# EAGLE design MIDI (EAGLE 6.5.0)
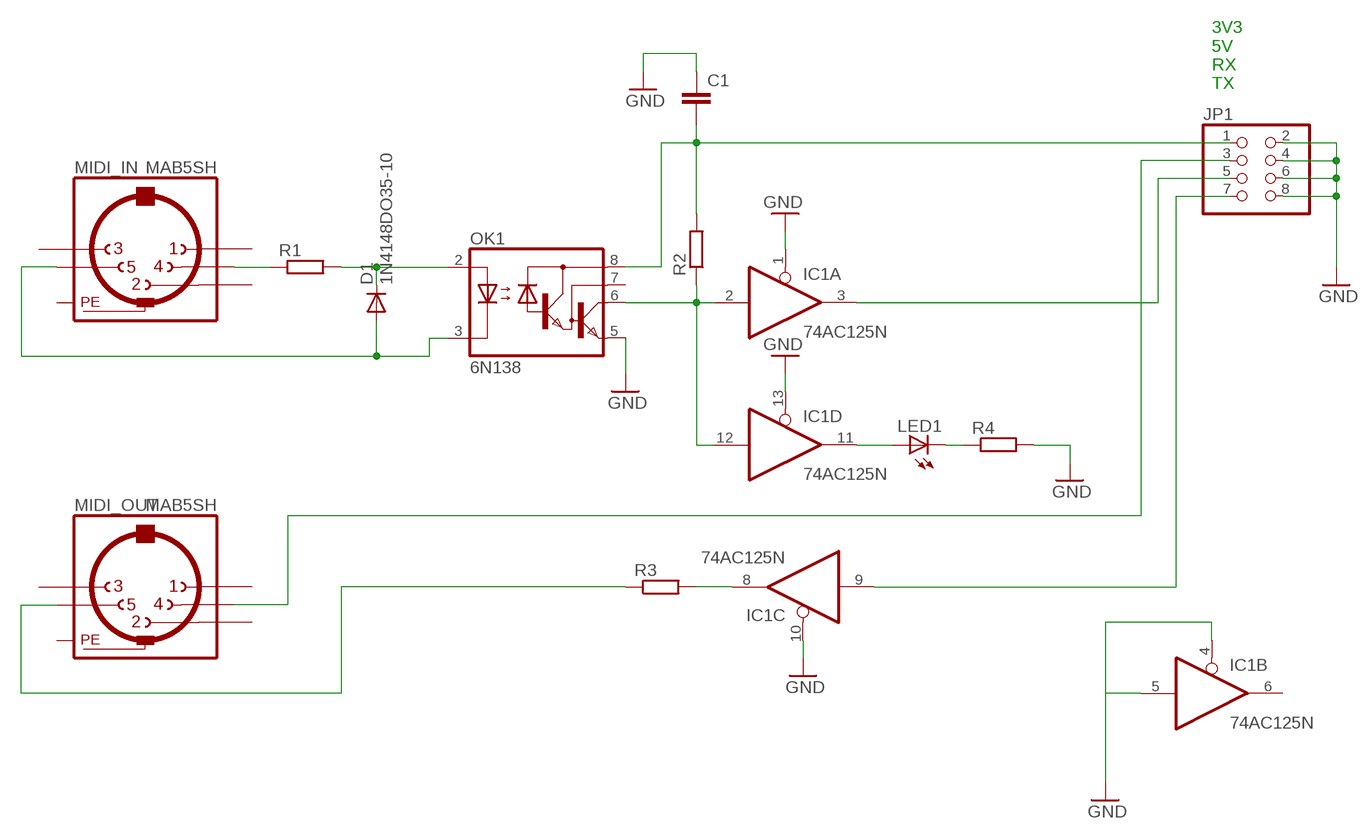
[diagram p0: schematic, sheet 1]

## Parts
C1  C-EU050-024X044  [C050-024X044]
D1  1N4148DO35-10  [DO35-10]
IC1  74AC125N  [DIL14]
JP1  PINHD-2X4  [2X04]
LED1  LED3MM  [LED3MM]
MIDI_IN  MAB5SH  [MAB5SH]
MIDI_OUT  MAB5SH  [MAB5SH]
OK1  6N138  [DIL08]
R1  R-EU_0207/5V  [0207/5V]
R2  R-EU_0207/5V  [0207/5V]
R3  R-EU_0207/5V  [0207/5V]
R4  R-EU_0207/5V  [0207/5V]

## Nets
GND: C1.1 IC1.1(A:OE) IC1.4(B:OE) IC1.5(B:I) IC1.10(C:OE) IC1.13(D:OE) JP1.2 JP1.4 JP1.6 JP1.8 OK1.5(GND) R4.2
N$1: MIDI_IN.4 R1.1
N$2: D1.C OK1.2(A) R1.2
N$3: D1.A MIDI_IN.5 OK1.3(C)
N$4: IC1.8(C:O) R3.2
N$5: IC1.2(A:I) IC1.12(D:I) OK1.6(VO) R2.1
N$6: IC1.3(A:O) JP1.5
N$7: MIDI_OUT.5 R3.1
N$8: JP1.3 MIDI_OUT.4
N$9: IC1.9(C:I) JP1.7
N$10: IC1.11(D:O) LED1.A
N$12: LED1.K(C) R4.1
VCC: C1.2 JP1.1 OK1.8(VCC) R2.2
Unconnected: IC1.6(B:O) MIDI_IN.1 MIDI_IN.2 MIDI_IN.3 MIDI_OUT.1 MIDI_OUT.2 MIDI_OUT.3 OK1.7(VB)

## Notes on the sheet
- 3V3
  5V
  RX
  TX

## Power pins joined to a net without a drawn wire
GND: IC1.7(P:GND) MIDI_IN.PE MIDI_IN.PE@(PE) MIDI_OUT.PE MIDI_OUT.PE@(PE)
VCC: IC1.14(P:VCC)

## Library data of the parts
C1 = resistor:C-EU: CAPACITOR, European symbol
D1 = diode:1N4148: DIODE high speed (Philips)
IC1 = 74xx-eu:74*125: Quad bus BUFFER, 3-state
JP1 = pinhead:PINHD-2X4: PIN HEADER
LED1 = led:LED: LED OSRAM: - CHIPLED LG R971, LG N971, LY N971, LG Q971, LY Q971, LO R971, LY R971 LH N974, LH R974 LS Q976, LO Q976, LY Q976 LO Q996 - Hyper CHIPLED LW Q18S LB Q993, LB Q99A, LB R99A - SideLED LS A670, LO A670, LY A670, LG A670, LP A670 LB A673, LV A673, LT A673, LW A673 LH A674 LY A675 LS A676, LA A676, LO A676, LY A676, LW A676 LS A679, LY A679, LG A679 - Hyper Micro SIDELED® LS Y876, LA Y876, LO Y876, LY Y876 LT Y87S - SmartLED LW L88C, LW L88S LB L89C, LB L89S, LG L890 LS L89K, LO L89K, LY L89K LS L896, LA L896, LO L896, LY L896 - TOPLED LS T670, LO T670, LY T670, LG T670, LP T670 LSG T670, LSP T670, LSY T670, LOP T670, LYG T670 LG T671, LOG T671, LSG T671 LB T673, LV T673, LT T673, LW T673 LH T674 LS T676, LA T676, LO T676, LY T676, LB T676, LH T676, LSB T676, LW T676 LB T67C, LV T67C, LT T67C, LS T67K, LO T67K, LY T67K, LW E67C LS E67B, LA E67B, LO E67B, LY E67B, LB E67C, LV E67C, LT E67C LW T67C LS T679, LY T679, LG T679 LS T770, LO T770, LY T770, LG T770, LP T770 LB T773, LV T773, LT T773, LW T773 LH T774 LS E675, LA E675, LY E675, LS T675 LS T776, LA T776, LO T776, LY T776, LB T776 LHGB T686 LT T68C, LB T68C - Hyper Mini TOPLED® LB M676 - Mini TOPLED Santana® LG M470 LS M47K, LO M47K, LY M47K Source: http://www.osram.convergy.de LUXEON: - LUMILED® LXK2-PW12-R00, LXK2-PW12-S00, LXK2-PW14-U00, LXK2-PW14-V00 LXK2-PM12-R00, LXK2-PM12-S00, LXK2-PM14-U00 LXK2-PE12-Q00, LXK2-PE12-R00, LXK2-PE12-S00, LXK2-PE14-T00, LXK2-PE14-U00 LXK2-PB12-K00, LXK2-PB12-L00, LXK2-PB12-M00, LXK2-PB14-N00, LXK2-PB14-P00, LXK2-PB14-Q00 LXK2-PR12-L00, LXK2-PR12-M00, LXK2-PR14-Q00, LXK2-PR14-R00 LXK2-PD12-Q00, LXK2-PD12-R00, LXK2-PD12-S00 LXK2-PH12-R00, LXK2-PH12-S00 LXK2-PL12-P00, LXK2-PL12-Q00, LXK2-PL12-R00 Source: www.luxeon.com KINGBRIGHT: KA-3528ASYC Source: www.kingbright.com
MIDI_IN MIDI_OUT = con-hirschmann:MAB5SH: Female CONNECTOR 5 pins 90 deg. with shield, horizontal (DIN 41524); OC_FARNELL: 809883; OC_NEWARK: unknown
OK1 = optocoupler:6N138: MOTOROLA OPTO COUPLER; MF: VISHAY/TELEFUNKEN; MPN: 6N138; OC_FARNELL: 9860150; OC_NEWARK: 35K5294
R1-R4 = resistor:R-EU_: RESISTOR, European symbol

## Board
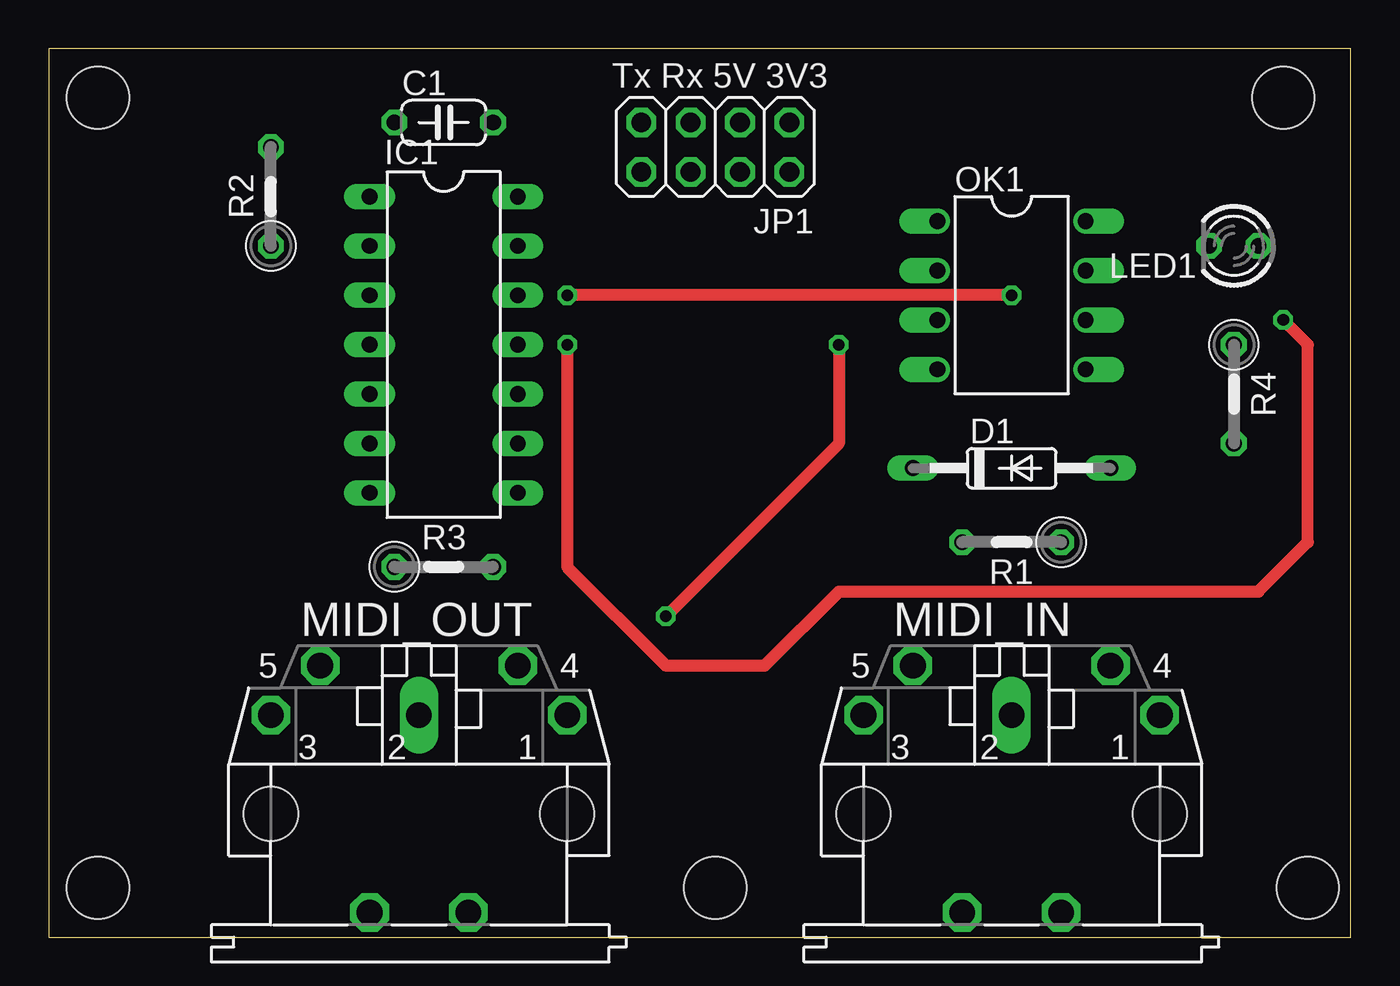
[diagram p1: board, top side]
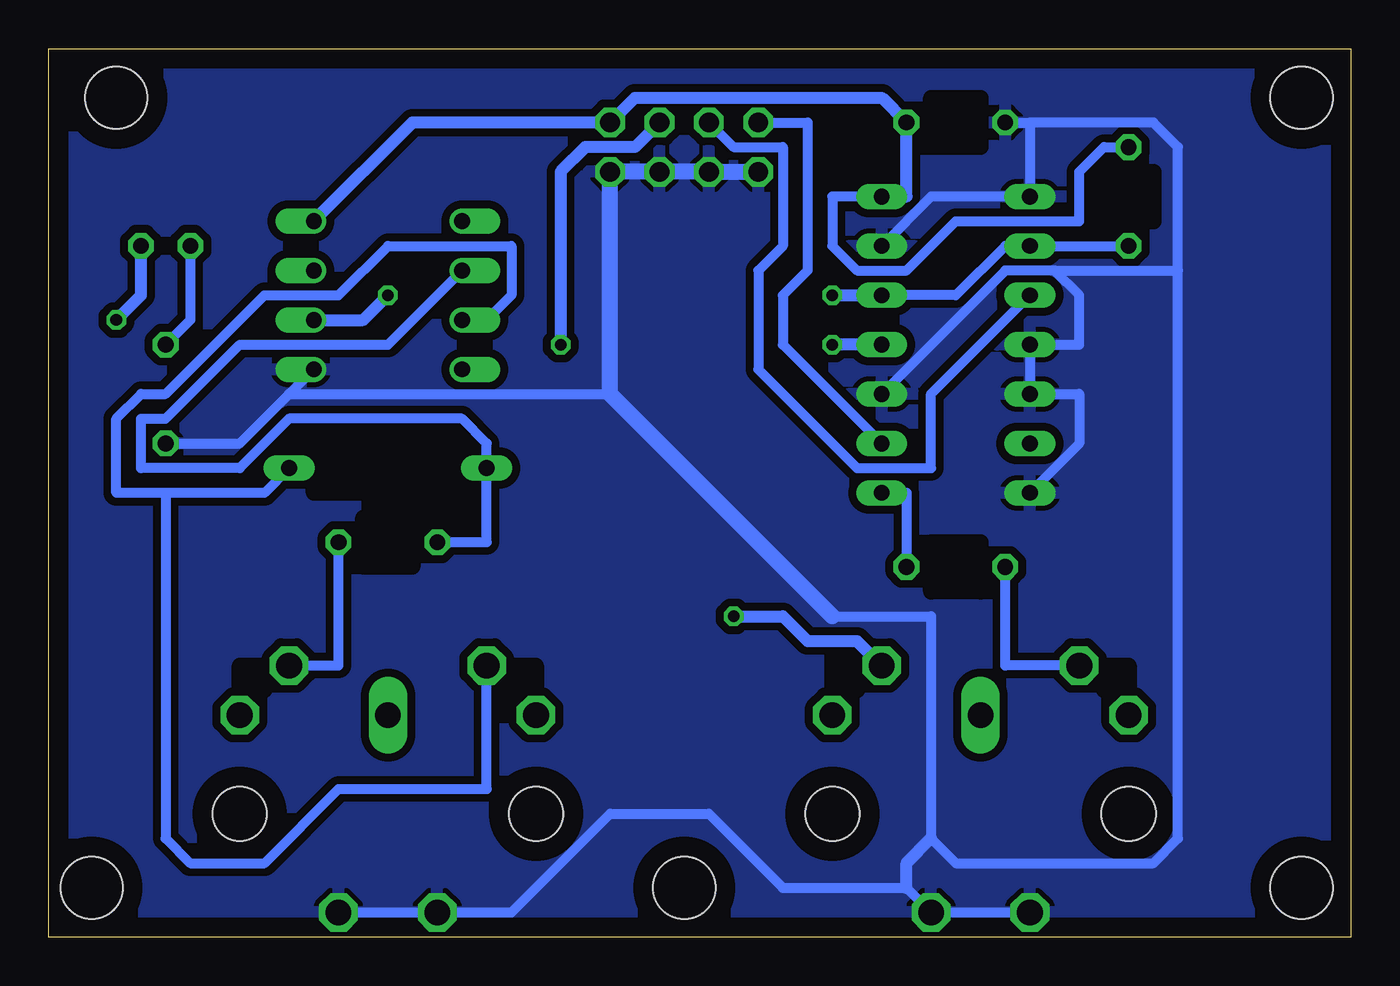
[diagram p2: board, bottom side, seen from below]

Size 66.98 x 45.71 mm. Coordinates in mm from the lower left corner, seen from the top.
Outline: 0,0 66.98,0 66.98,45.71 0,45.71 0,0
Copper layers (1*16): Top 0.035mm / dielectric 1.5mm / Bottom 0.035mm
Design rules "default *": minimum track width 20mil, minimum drill 24mil, track to track 8mil, track to pad 8mil, pad to pad 8mil, via to via 8mil, smd to smd 8mil, copper to edge 40mil, drill to drill 8mil, minimum pad ring 10mil, minimum via ring 8mil, stop-mask expansion 4mil, vias tented up to drill 0mil, thermal gap 10mil
Holes 3.2 mm at 2.54,2.54 2.54,43.18 64.77,2.54 63.5,43.18 34.29,2.54
bRestrict: area 45.7,22.9 to 53.3,25.4; area 48.3,19.1 to 50.8,21.6; area 41.9,12.7 to 43.2,14; area 55.9,12.7 to 57.1,14; area 25.4,12.7 to 26.7,14; area 11.4,12.7 to 12.7,14; area 19.1,17.8 to 21.6,20.3; area 19.1,40.6 to 21.6,43.2; area 10.2,36.8 to 12.7,39.4

### Footprints (pad centres in the part's own frame; a part is rotated, then mirrored left to right if it is on the bottom)
C050-024X044 = drill 0.813 octagon: 1 -2.54,0; 2 2.54,0
DO35-10 = drill 0.813 long: A 5.08,0; C -5.08,0
DIL14 = drill 0.813 long: 1 -7.62,-3.81; 2 -5.08,-3.81; 3 -2.54,-3.81; 4 0,-3.81; 5 2.54,-3.81; 6 5.08,-3.81; 7 7.62,-3.81; 8 7.62,3.81; 9 5.08,3.81; 10 2.54,3.81; 11 0,3.81; 12 -2.54,3.81; 13 -5.08,3.81; 14 -7.62,3.81
2X04 = drill 1.016 octagon: 1 -3.81,-1.27; 2 -3.81,1.27; 3 -1.27,-1.27; 4 -1.27,1.27; 5 1.27,-1.27; 6 1.27,1.27; 7 3.81,-1.27; 8 3.81,1.27
LED3MM = drill 0.813 octagon: A -1.27,0; K 1.27,0
MAB5SH = drill 1.321 octagon: 1 7.62,5.08; 3 -7.62,5.08; 4 5.08,7.62; 5 -5.08,7.62; PE -2.54,-5.08; PE@ 2.54,-5.08 | drill 1.321 long: 2 0,5.08 | hole 2.794: 7.62,0; -7.62,0
DIL08 = drill 0.813 offset: 1 -3.81,-3.81; 2 -1.27,-3.81; 3 1.27,-3.81; 4 3.81,-3.81; 5 3.81,3.81; 6 1.27,3.81; 7 -1.27,3.81; 8 -3.81,3.81
0207/5V = drill 0.813 octagon: 1 -2.54,0; 2 2.54,0

### Placement (x,y rotation side)
C1  20.32,41.91 0 top
D1  49.53,24.13 0 top
IC1  20.32,30.48 270 top
JP1  34.29,40.64 180 top
LED1  60.96,35.56 180 top
MIDI_IN  49.53,6.35 0 top
MIDI_OUT  19.05,6.35 0 top
OK1  49.53,33.02 270 top
R1  49.53,20.32 180 top
R2  11.43,38.1 90 top
R3  20.32,19.05 0 top
R4  60.96,27.94 270 top

### Tracks (layer width: path | path; a pad name or v marks a point on that pad's centre or on a via)
GND
  Bottom 0.508: 16.51,41.91 IC1.1 21.59,38.1 IC1.13 | C1.1 16.51,41.91 | IC1.7 13.97,25.4 13.97,27.94 IC1.5 IC1.4 13.97,30.48 13.97,33.02 15.24,34.29 | IC1.10 17.78,34.29 15.24,34.29 | 16.51,41.91 10.16,41.91 8.89,40.64 8.89,34.29 | 15.24,34.29 8.89,34.29 | 54.61,27.94 57.15,25.4 R4.2 | 54.61,27.94 OK1.5 | 54.61,27.94 38.1,27.94 | 8.89,34.29 8.89,5.08 10.16,3.81 20.32,3.81 21.59,5.08 21.59,16.51 26.67,16.51 | MIDI_OUT.PE MIDI_OUT.PE@ 22.86,2.54 29.21,2.54 33.02,6.35 38.1,6.35 43.18,1.27 MIDI_IN.PE MIDI_IN.PE@
  Bottom 0.61: 22.86,2.54 22.86,3.81 21.59,5.08
  Bottom 0.813: JP1.8 JP1.6 JP1.4 JP1.2 38.1,27.94 26.67,16.51
  pour Bottom (isolate 0.406): 0,45.72 67.31,45.72 67.31,0 0,0
N$1
  Bottom 0.508: R1.1 52.07,13.97 MIDI_IN.4
N$2
  Bottom 0.508: R1.2 44.45,20.32 D1.C 44.45,25.4 45.72,26.67 54.61,26.67 57.15,24.13 62.23,24.13 62.23,26.67 60.96,26.67 57.15,30.48 49.53,30.48 OK1.2
N$3
  Bottom 0.508: OK1.3 44.45,31.75 43.18,33.02 43.18,35.56 49.53,35.56 52.07,33.02 55.88,33.02 60.96,27.94 62.23,27.94 63.5,26.67 63.5,22.86 60.96,22.86 | 60.96,22.86 55.88,22.86 D1.A | MIDI_IN.5 44.45,7.62 52.07,7.62 55.88,3.81 59.69,3.81 60.96,5.08 60.96,22.86
N$4
  Bottom 0.508: R3.2 22.86,22.86 IC1.8
N$5  (via drill 0.6)
  Top 0.61: v49.53,33.02 v26.67,33.02
  Bottom 0.508: R2.1 IC1.2 17.78,35.56 20.32,33.02 IC1.12
  Bottom 0.61: OK1.6 50.8,31.75 v49.53,33.02 | v26.67,33.02 IC1.12
N$6
  Bottom 0.508: IC1.3 21.59,27.94 21.59,24.13 25.4,24.13 29.21,27.94 30.48,29.21 30.48,34.29 29.21,35.56 29.21,40.64 31.75,40.64 JP1.5
N$7
  Bottom 0.508: R3.1 17.78,13.97 MIDI_OUT.5
N$8  (via drill 0.6)
  Top 0.61: v40.64,30.48 40.64,25.4 v31.75,16.51
  Bottom 0.61: JP1.3 36.83,40.64 39.37,40.64 40.64,39.37 v40.64,30.48 | v31.75,16.51 29.21,16.51 27.94,15.24 25.4,15.24 MIDI_OUT.4
N$9
  Bottom 0.508: IC1.9 29.21,30.48 29.21,33.02 27.94,34.29 27.94,41.91 JP1.7
N$10  (via drill 0.6)
  Top 0.61: v26.67,30.48 26.67,19.05 31.75,13.97 36.83,13.97 40.64,17.78 62.23,17.78 64.77,20.32 64.77,30.48 v63.5,31.75
  Bottom 0.61: IC1.11 v26.67,30.48 | v63.5,31.75 62.23,33.02 LED1.A
N$12
  Bottom 0.508: R4.1 59.69,31.75 LED1.K
VCC
  Bottom 0.508: R2.2 12.7,40.64 13.97,39.37 13.97,36.83 20.32,36.83 22.86,34.29 25.4,34.29 26.67,35.56 26.67,38.1 IC1.14
  Bottom 0.61: IC1.14 22.86,38.1 C1.2 24.13,43.18 36.83,43.18 JP1.1 48.26,41.91 OK1.8

### Text on the board
tNames: Tx Rx 5V 3V3